# EAGLE design chariot_sensor (EAGLE 9.2.2)
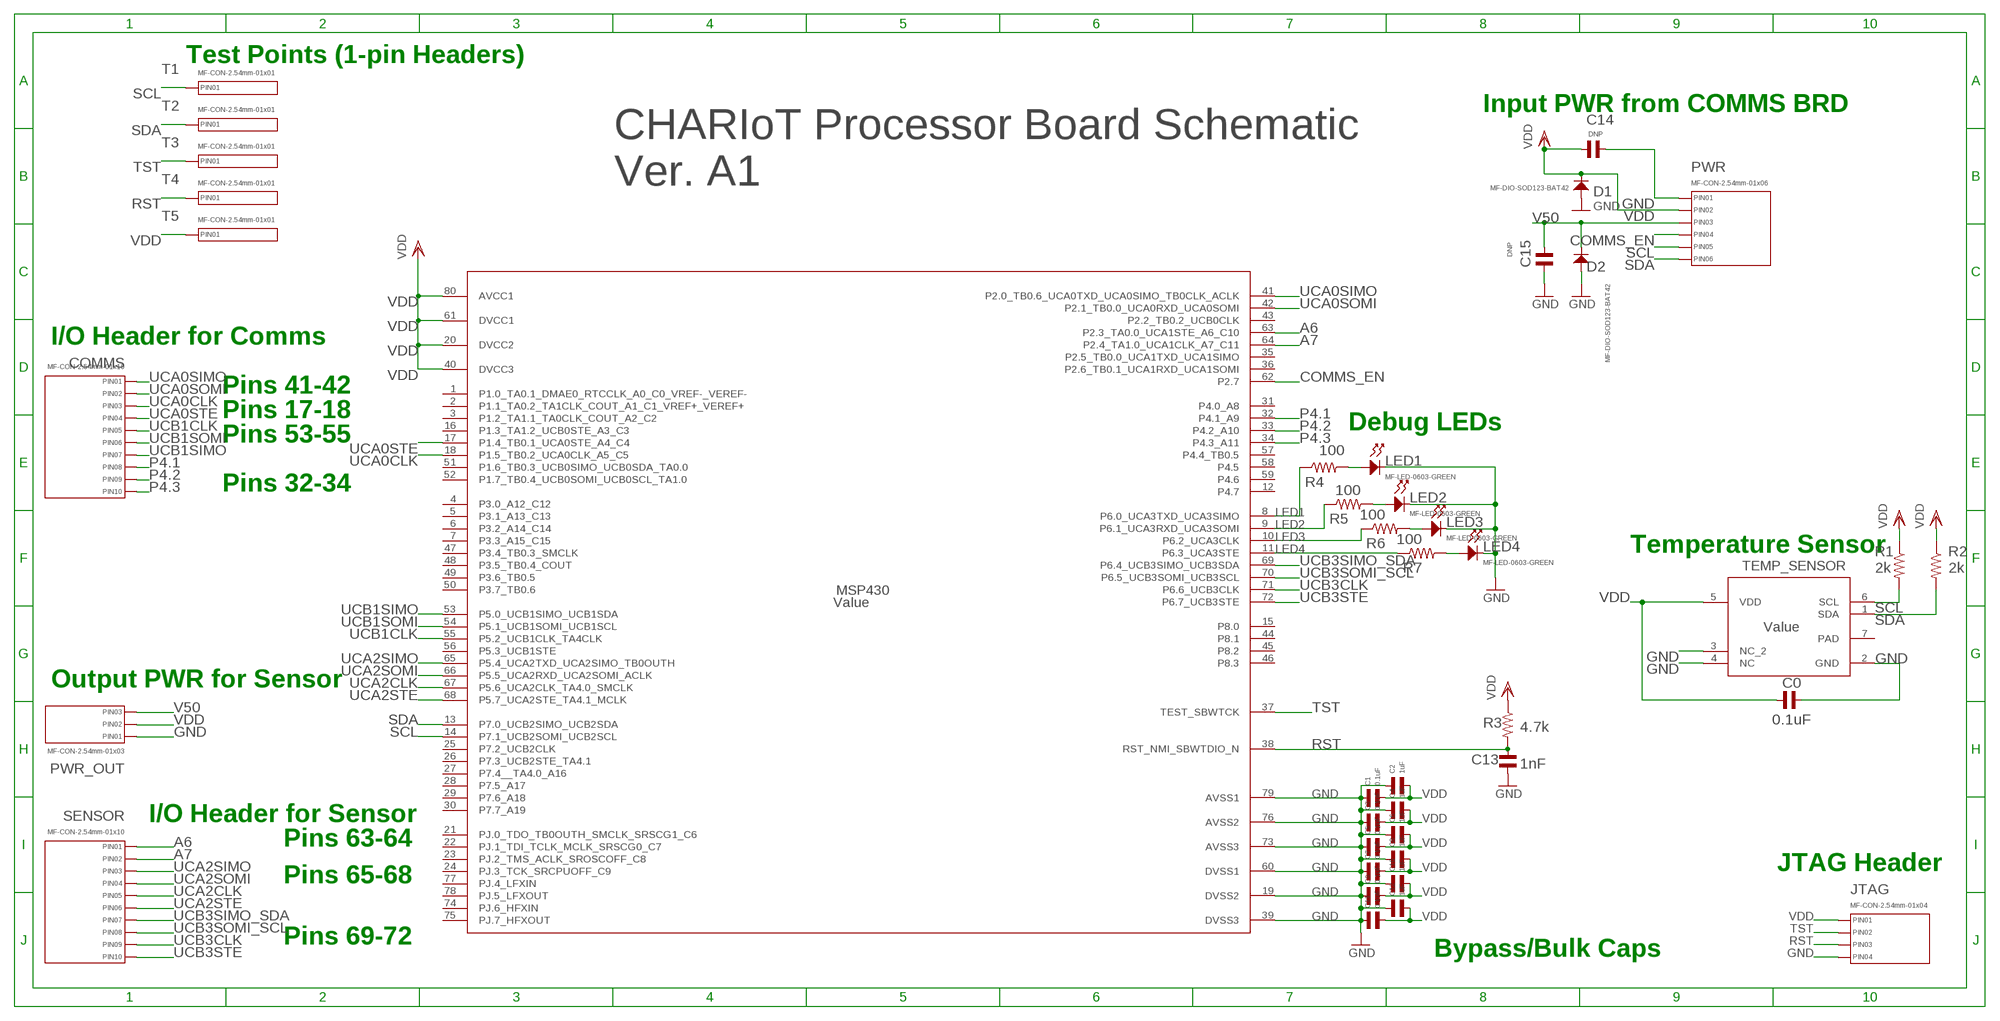
[diagram p0: schematic, sheet 1]

## Parts
C0  0.1uF  CAPACITOR_NP_0603  [C0603]
C1  0.1uF  CAPACITOR_NP_0603  [C0603]
C2  1uF  CAPACITOR_NP_0603  [C0603]
C3  0.1uF  CAPACITOR_NP_0603  [C0603]
C4  1uF  CAPACITOR_NP_0603  [C0603]
C5  0.1uF  CAPACITOR_NP_0603  [C0603]
C6  1uF  CAPACITOR_NP_0603  [C0603]
C7  0.1uF  CAPACITOR_NP_0603  [C0603]
C8  1uF  CAPACITOR_NP_0603  [C0603]
C9  0.1uF  CAPACITOR_NP_0603  [C0603]
C10  1uF  CAPACITOR_NP_0603  [C0603]
C11  0.1uF  CAPACITOR_NP_0603  [C0603]
C12  1uF  CAPACITOR_NP_0603  [C0603]
C13  1nF  CAPACITOR_NP_0603  [C0603]
C14  DNP  CAPACITOR_NP_0603  [C0603]
C15  DNP  CAPACITOR_NP_0603  [C0603]
COMMS  MF-CON-2.54mm-01x10  CON_01X10_PTH_2.54MM  [PTH_2.54MM_01X10]
D1  MF-DIO-SOD123-BAT42  DIODES_BAT42_SOD-123  [SOD-123]
D2  MF-DIO-SOD123-BAT42  DIODES_BAT42_SOD-123  [SOD-123]
JTAG  MF-CON-2.54mm-01x04  CON_01X04_PTH_2.54MM  [PTH_2.54MM_01X04]
LED1  MF-LED-0603-GREEN  LED_SINGLE-0603-GREEN  [LED0603]
LED2  MF-LED-0603-GREEN  LED_SINGLE-0603-GREEN  [LED0603]
LED3  MF-LED-0603-GREEN  LED_SINGLE-0603-GREEN  [LED0603]
LED4  MF-LED-0603-GREEN  LED_SINGLE-0603-GREEN  [LED0603]
MSP430  Value  MSP430FR5994IPNR  [PN0080A_N]
PWR  MF-CON-2.54mm-01x06  CON_01X06_PTH_2.54MM  [PTH_2.54MM_01X06]
PWR_OUT  MF-CON-2.54mm-01x03  CON_01X03_PTH_2.54MM  [PTH_2.54MM_01X03]
R1  2k  RESISTOR_0603  [R0603]
R2  2k  RESISTOR_0603  [R0603]
R3  4.7k  RESISTOR_0603  [R0603]
R4  100  RESISTOR_0603  [R0603]
R5  100  RESISTOR_0603  [R0603]
R6  100  RESISTOR_0603  [R0603]
R7  100  RESISTOR_0603  [R0603]
SENSOR  MF-CON-2.54mm-01x10  CON_01X10_PTH_2.54MM  [PTH_2.54MM_01X10]
T1  MF-CON-2.54mm-01x01  CON_01X01_PTH_2.54MM  [PTH_2.54MM_01X01]
T2  MF-CON-2.54mm-01x01  CON_01X01_PTH_2.54MM  [PTH_2.54MM_01X01]
T3  MF-CON-2.54mm-01x01  CON_01X01_PTH_2.54MM  [PTH_2.54MM_01X01]
T4  MF-CON-2.54mm-01x01  CON_01X01_PTH_2.54MM  [PTH_2.54MM_01X01]
T5  MF-CON-2.54mm-01x01  CON_01X01_PTH_2.54MM  [PTH_2.54MM_01X01]
TEMP_SENSOR  Value  HDC1080DMBR  [DMB0006A]

## Nets
A6: MSP430.63(P2.3_TA0.0_UCA1STE_A6_C10) SENSOR.P$1(PIN1)
A7: MSP430.64(P2.4_TA1.0_UCA1CLK_A7_C11) SENSOR.P$2(PIN2)
COMMS_EN: MSP430.62(P2.7) PWR.P$4(PIN4)
GND: C0.P$2 C1.P$1 C2.P$1 C3.P$1 C4.P$1 C5.P$1 C6.P$1 C7.P$1 C8.P$1 C9.P$1 C10.P$1 C11.P$1 C12.P$1 C13.P$2 C14.P$2 C15.P$2 D1.ANODE D2.ANODE JTAG.P$4(PIN4) LED1.CATHODE LED2.CATHODE LED3.CATHODE LED4.CATHODE MSP430.19(DVSS2) MSP430.39(DVSS3) MSP430.60(DVSS1) MSP430.73(AVSS3) MSP430.76(AVSS2) MSP430.79(AVSS1) PWR.P$1(PIN1) PWR_OUT.P$1(PIN1) TEMP_SENSOR.2(GND) TEMP_SENSOR.3(NC_2) TEMP_SENSOR.4(NC)
LED1: MSP430.8(P6.0_UCA3TXD_UCA3SIMO) R4.P$1
LED2: MSP430.9(P6.1_UCA3RXD_UCA3SOMI) R5.P$1
LED3: MSP430.10(P6.2_UCA3CLK) R6.P$1
LED4: MSP430.11(P6.3_UCA3STE) R7.P$1
N$1: LED1.ANODE R4.P$2
N$2: LED2.ANODE R5.P$2
N$3: LED3.ANODE R6.P$2
N$4: LED4.ANODE R7.P$2
P4.1: COMMS.P$8(PIN8) MSP430.32(P4.1_A9)
P4.2: COMMS.P$9(PIN9) MSP430.33(P4.2_A10)
P4.3: COMMS.P$10(PIN10) MSP430.34(P4.3_A11)
RST: C13.P$1 JTAG.P$3(PIN3) MSP430.38(RST_NMI_SBWTDIO_N) R3.P$2 T4.P$1(PIN1)
SCL: MSP430.14(P7.1_UCB2SOMI_UCB2SCL) PWR.P$5(PIN5) R1.P$2 T1.P$1(PIN1) TEMP_SENSOR.6(SCL)
SDA: MSP430.13(P7.0_UCB2SIMO_UCB2SDA) PWR.P$6(PIN6) R2.P$2 T2.P$1(PIN1) TEMP_SENSOR.1(SDA)
TST: JTAG.P$2(PIN2) MSP430.37(TEST_SBWTCK) T3.P$1(PIN1)
UCA0CLK: COMMS.P$3(PIN3) MSP430.18(P1.5_TB0.2_UCA0CLK_A5_C5)
UCA0SIMO: COMMS.P$1(PIN1) MSP430.41(P2.0_TB0.6_UCA0TXD_UCA0SIMO_TB0CLK_ACLK)
UCA0SOMI: COMMS.P$2(PIN2) MSP430.42(P2.1_TB0.0_UCA0RXD_UCA0SOMI)
UCA0STE: COMMS.P$4(PIN4) MSP430.17(P1.4_TB0.1_UCA0STE_A4_C4)
UCA2CLK: MSP430.67(P5.6_UCA2CLK_TA4.0_SMCLK) SENSOR.P$5(PIN5)
UCA2SIMO: MSP430.65(P5.4_UCA2TXD_UCA2SIMO_TB0OUTH) SENSOR.P$3(PIN3)
UCA2SOMI: MSP430.66(P5.5_UCA2RXD_UCA2SOMI_ACLK) SENSOR.P$4(PIN4)
UCA2STE: MSP430.68(P5.7_UCA2STE_TA4.1_MCLK) SENSOR.P$6(PIN6)
UCB1CLK: COMMS.P$5(PIN5) MSP430.55(P5.2_UCB1CLK_TA4CLK)
UCB1SIMO: COMMS.P$7(PIN7) MSP430.53(P5.0_UCB1SIMO_UCB1SDA)
UCB1SOMI: COMMS.P$6(PIN6) MSP430.54(P5.1_UCB1SOMI_UCB1SCL)
UCB3CLK: MSP430.71(P6.6_UCB3CLK) SENSOR.P$9(PIN9)
UCB3SIMO_SDA: MSP430.69(P6.4_UCB3SIMO_UCB3SDA) SENSOR.P$7(PIN7)
UCB3SOMI_SCL: MSP430.70(P6.5_UCB3SOMI_UCB3SCL) SENSOR.P$8(PIN8)
UCB3STE: MSP430.72(P6.7_UCB3STE) SENSOR.P$10(PIN10)
V50: C15.P$1 D2.CATHODE PWR.P$3(PIN3) PWR_OUT.P$3(PIN3)
VDD: C0.P$1 C1.P$2 C2.P$2 C3.P$2 C4.P$2 C5.P$2 C6.P$2 C7.P$2 C8.P$2 C9.P$2 C10.P$2 C11.P$2 C12.P$2 C14.P$1 D1.CATHODE JTAG.P$1(PIN1) MSP430.20(DVCC2) MSP430.40(DVCC3) MSP430.61(DVCC1) MSP430.80(AVCC1) PWR.P$2(PIN2) PWR_OUT.P$2(PIN2) R1.P$1 R2.P$1 R3.P$1 T5.P$1(PIN1) TEMP_SENSOR.5(VDD)
Unconnected: MSP430.1(P1.0_TA0.1_DMAE0_RTCCLK_A0_C0_VREF-_VEREF-) MSP430.2(P1.1_TA0.2_TA1CLK_COUT_A1_C1_VREF+_VEREF+) MSP430.3(P1.2_TA1.1_TA0CLK_COUT_A2_C2) MSP430.4(P3.0_A12_C12) MSP430.5(P3.1_A13_C13) MSP430.6(P3.2_A14_C14) MSP430.7(P3.3_A15_C15) MSP430.12(P4.7) MSP430.15(P8.0) MSP430.16(P1.3_TA1.2_UCB0STE_A3_C3) MSP430.21(PJ.0_TDO_TB0OUTH_SMCLK_SRSCG1_C6) MSP430.22(PJ.1_TDI_TCLK_MCLK_SRSCG0_C7) MSP430.23(PJ.2_TMS_ACLK_SROSCOFF_C8) MSP430.24(PJ.3_TCK_SRCPUOFF_C9) MSP430.25(P7.2_UCB2CLK) MSP430.26(P7.3_UCB2STE_TA4.1) MSP430.27(P7.4__TA4.0_A16) MSP430.28(P7.5_A17) MSP430.29(P7.6_A18) MSP430.30(P7.7_A19) MSP430.31(P4.0_A8) MSP430.35(P2.5_TB0.0_UCA1TXD_UCA1SIMO) MSP430.36(P2.6_TB0.1_UCA1RXD_UCA1SOMI) MSP430.43(P2.2_TB0.2_UCB0CLK) MSP430.44(P8.1) MSP430.45(P8.2) MSP430.46(P8.3) MSP430.47(P3.4_TB0.3_SMCLK) MSP430.48(P3.5_TB0.4_COUT) MSP430.49(P3.6_TB0.5) MSP430.50(P3.7_TB0.6) MSP430.51(P1.6_TB0.3_UCB0SIMO_UCB0SDA_TA0.0) MSP430.52(P1.7_TB0.4_UCB0SOMI_UCB0SCL_TA1.0) MSP430.56(P5.3_UCB1STE) MSP430.57(P4.4_TB0.5) MSP430.58(P4.5) MSP430.59(P4.6) MSP430.74(PJ.6_HFXIN) MSP430.75(PJ.7_HFXOUT) MSP430.77(PJ.4_LFXIN) MSP430.78(PJ.5_LFXOUT)

## Notes on the sheet
- Test Points (1-pin Headers)
- Input PWR from COMMS BRD
- CHARIoT Processor Board Schematic 
  Ver. A1
- I/O Header for Comms
- Pins 41-42
- Pins 17-18
- Debug LEDs
- Pins 53-55
- Pins 32-34
- Temperature Sensor
- Output PWR for Sensor
- I/O Header for Sensor
- Pins 63-64
- JTAG Header
- Pins 65-68
- Pins 69-72
- Bypass/Bulk Caps

## Power pins joined to a net without a drawn wire
PAD: TEMP_SENSOR.7(PAD)

## Library data of the parts
C0 C1-C15 = MF_Passives:CAPACITOR_NP: Library: MF_Passives Description: Device for Non-Polarized Capacitors. Manufacture part number (MPN) can be added via Attributes. Check https://factory.macrofab.com/parts for the house parts list.; POPULATE: 1
COMMS SENSOR = MF_Connectors:CON_01X10: Library: MF_Connectors Description: Header Connector with 10 Positions and 01 Rows. Use the LABEL Attribute to label the pin on the schematic and PCB. You can remove the attributes on the PCB by using the SMASH function on the part and then deleting the text.; HOUSEPART: YES; MPN: MF-CON-2.54mm-01x10; POPULATE: 1; URL: https://factory.macrofab.com/part/MF-CON-2.54mm-01x10
D1 D2 = MF_Discrete_Semiconductor:DIODES: Library: MF_Discrete_Semiconductor Description: Device for Single Packaged Diodes.; HOUSEPART: YES; MPN: MF-DIO-SOD123-BAT42; POPULATE: 1; URL: https://factory.macrofab.com/part/MF-DIO-SOD123-BAT42
JTAG = MF_Connectors:CON_01X04: Library: MF_Connectors Description: Header Connector with 04 Positions and 01 Rows. Use the LABEL Attribute to label the pin on the schematic and PCB. You can remove the attributes on the PCB by using the SMASH function on the part and then deleting the text.; HOUSEPART: YES; MPN: MF-CON-2.54mm-01x04; POPULATE: 1; URL: https://factory.macrofab.com/part/MF-CON-2.54mm-01x04
LED1-LED4 = MF_LEDs:LED_SINGLE: Library: MF_LEDs Description: Device for Single LED Packages. Manufacture part number (MFG#) can be added via Attributes.; HOUSEPART: YES; MPN: MF-LED-0603-GREEN; POPULATE: 1; URL: https://factory.macrofab.com/part/MF-LED-0603-GREEN
MSP430 = CharIoT:MSP430FR5994IPNR: Processor; MANUFACTURER: Texas Instruments; PARTNUMBER: MSP430FR5994IPNR; REFDES: RefDes; TYPE: TYPE
PWR = MF_Connectors:CON_01X06: Library: MF_Connectors Description: Header Connector with 6 Positions and 01 Rows. Use the LABEL Attribute to label the pin on the schematic and PCB. You can remove the attributes on the PCB by using the SMASH function on the part and then deleting the text.; HOUSEPART: YES; MPN: MF-CON-2.54mm-01x06; POPULATE: 1; URL: https://factory.macrofab.com/part/MF-CON-2.54mm-01x06
PWR_OUT = MF_Connectors:CON_01X03: Library: MF_Connectors Description: Header Connector with 03 Positions and 01 Rows. Use the LABEL Attribute to label the pin on the schematic and PCB. You can remove the attributes on the PCB by using the SMASH function on the part and then deleting the text.; HOUSEPART: YES; MPN: MF-CON-2.54mm-01x03; POPULATE: 1; URL: https://factory.macrofab.com/part/MF-CON-2.54mm-01x03
R1-R7 = MF_Passives:RESISTOR: Library: MF_Passives Description: Device for Resistors. Manufacture part number (MPN), Voltage, Tolerance, and Wattage Rating can be added via Attributes. Check https://factory.macrofab.com/parts for the house parts list.; POPULATE: 1
T1-T5 = MF_Connectors:CON_01X01: Library: MF_Connectors Description: Header Connector with 01 Positions and 01 Rows. Use the LABEL Attribute to label the pin on the schematic and PCB. You can remove the attributes on the PCB by using the SMASH function on the part and then deleting the text.; HOUSEPART: YES; MPN: MF-CON-2.54mm-01x01; POPULATE: 1; URL: https://factory.macrofab.com/part/MF-CON-2.54mm-01x01
TEMP_SENSOR = CharIoT:HDC1080DMBR: Temp Sensor; ALTERNATEPARTNUMBER: HDC1080DMBT; APPLICATION_BUILDNUMBER: *; COMPTYPE: IC; MANUFACTURER: Texas Instruments; MOUNTTYPE: SMT; PACKAGEREFERENCE: DMB0006A; PARTNUMBER: HDC1080DMBR; PIN_COUNT: 7; REFDES: RefDes; TYPE: TYPE

## Board
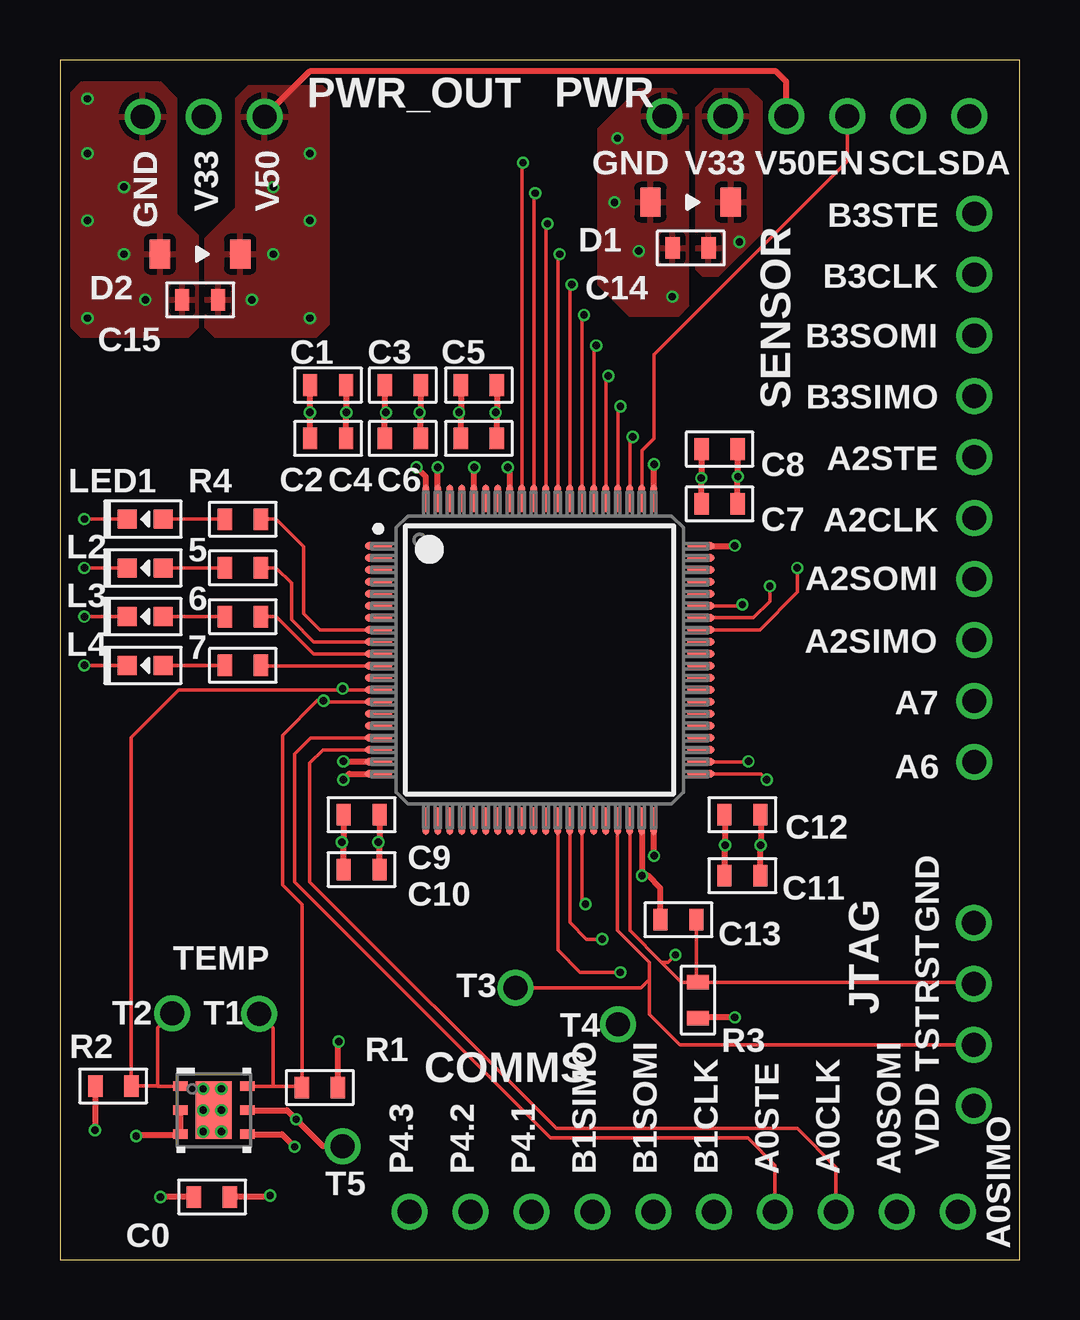
[diagram p1: board, top side]
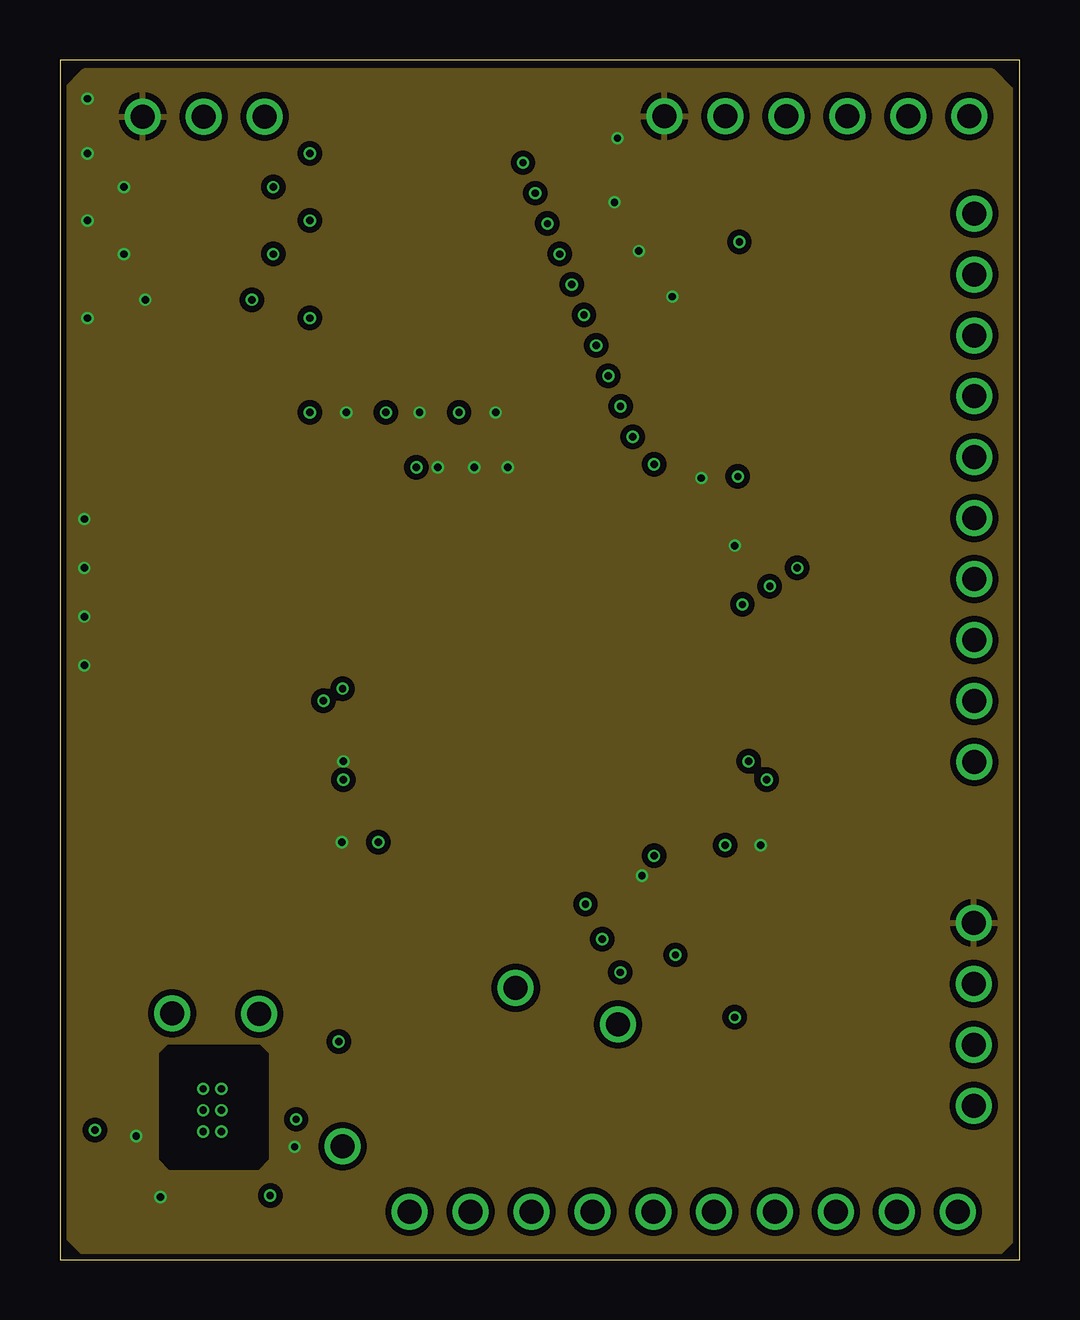
[diagram p2: board, inner layer Route2]
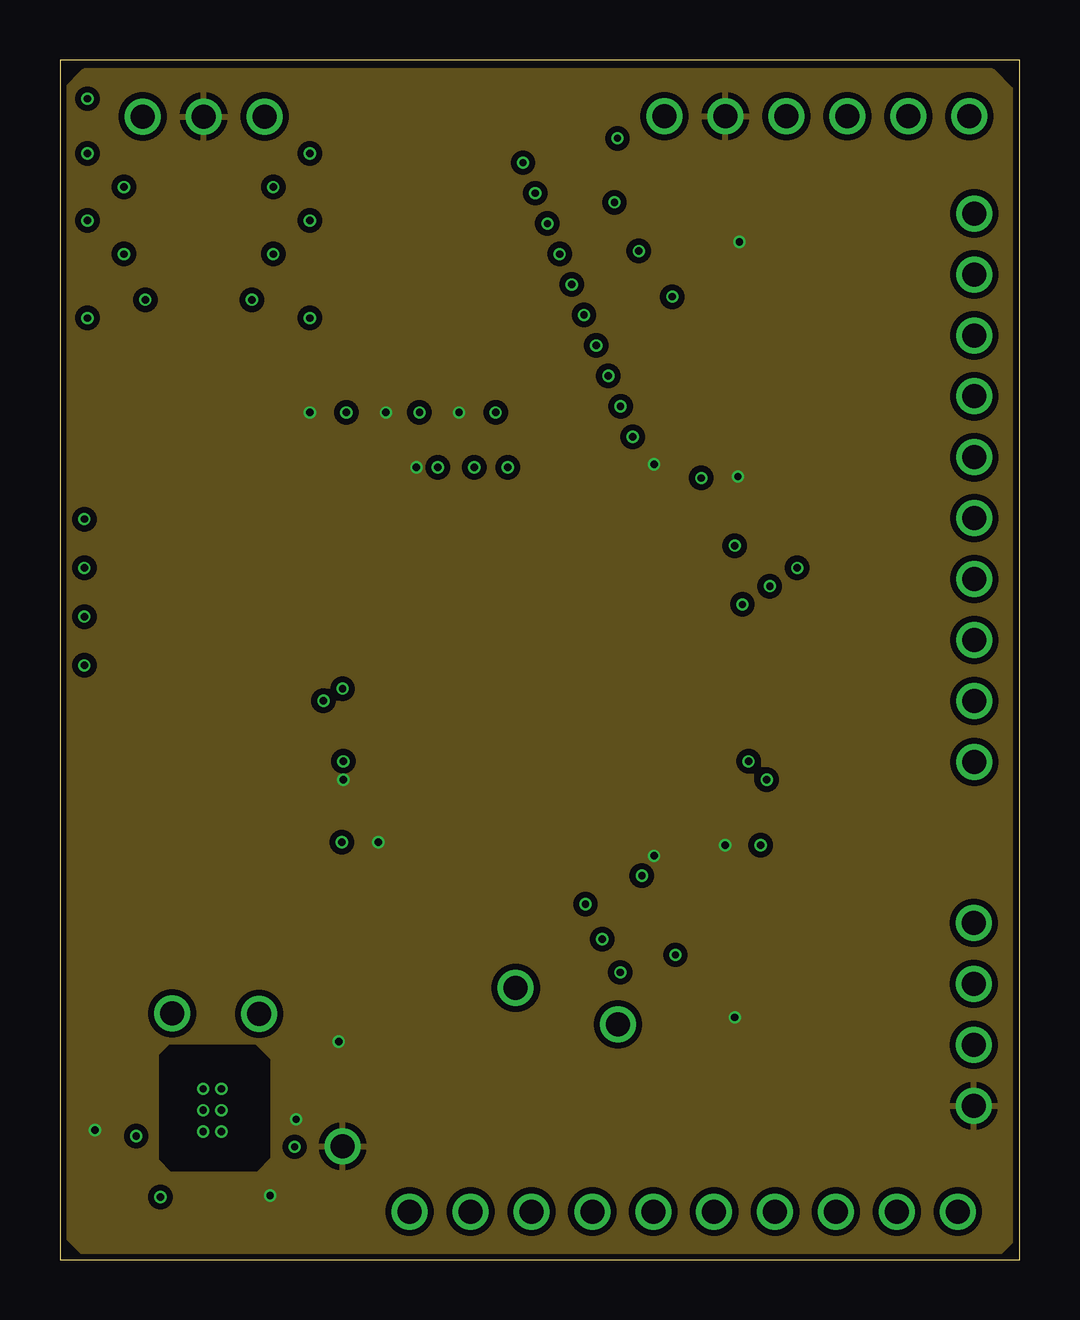
[diagram p3: board, inner layer Route15]
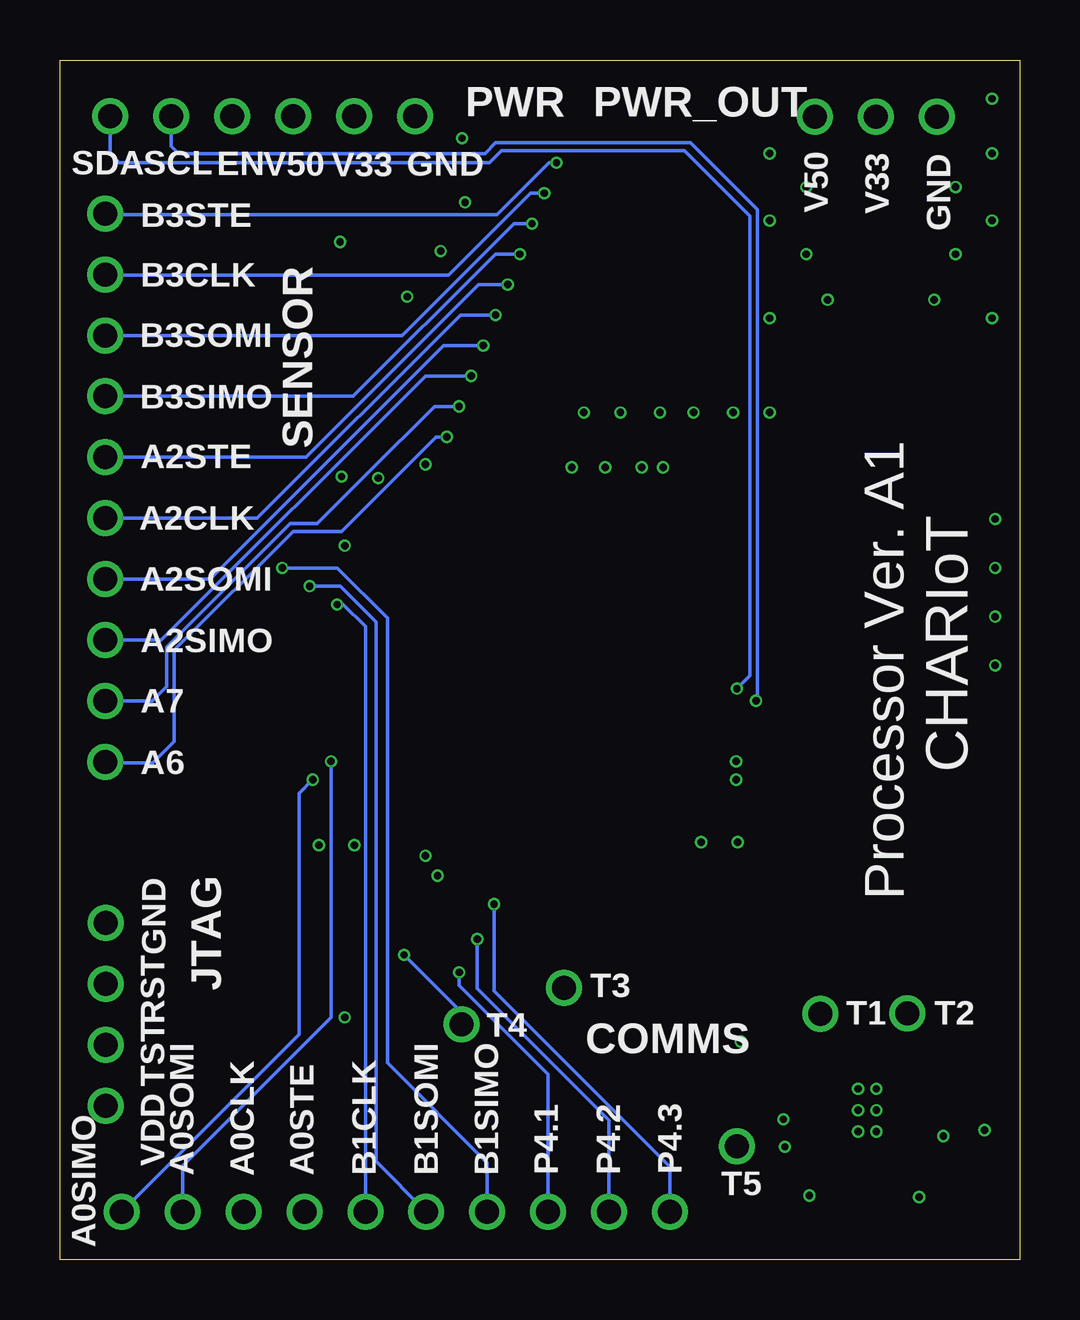
[diagram p4: board, bottom side, seen from below]

Size 40 x 50 mm. Coordinates in mm from the lower left corner, seen from the top.
Outline: 0,0 40,0 40,50 0,50 0,0
Copper layers (1*2*15*16): Top 0.035mm / dielectric 0.23mm / Route2 0.035mm / dielectric 0.93mm / Route15 0.035mm / dielectric 0.23mm / Bottom 0.035mm
Design rules "MF_Standard_4_Layer": minimum track width 5mil, minimum drill 10mil, track to track 5mil, track to pad 5mil, pad to pad 5mil, via to via 5mil, smd to smd 0mil, copper to edge 10mil, drill to drill 10mil, minimum pad ring 4mil, minimum via ring 4mil, stop-mask expansion 2mil, vias tented up to drill 25mil, thermal gap 10mil

### Footprints (pad centres in the part's own frame; a part is rotated, then mirrored left to right if it is on the bottom)
C0603 = smd 0.6 x 0.9: P$1 -0.75,0; P$2 0.75,0
PTH_2.54MM_01X10 = drill 1: P$1 -11.43,0; P$2 -8.89,0; P$3 -6.35,0; P$4 -3.81,0; P$5 -1.27,0; P$6 1.27,0; P$7 3.81,0; P$8 6.35,0; P$9 8.89,0; P$10 11.43,0
SOD-123 = smd 0.85 x 1.2: ANODE 1.675,0; CATHODE -1.675,0
PTH_2.54MM_01X04 = drill 1: P$1 -3.81,0; P$2 -1.27,0; P$3 1.27,0; P$4 3.81,0
LED0603 = smd 0.8 x 0.8: ANODE 0.75,0; CATHODE -0.75,0
PN0080A_N = smd 1.15 x 0.3: 1 -6.725,4.75; 2 -6.725,4.25; 3 -6.725,3.75; 4 -6.725,3.25; 5 -6.725,2.75; 6 -6.725,2.25; 7 -6.725,1.75; 8 -6.725,1.25; 9 -6.725,0.75; 10 -6.725,0.25; 11 -6.725,-0.25; 12 -6.725,-0.75; 13 -6.725,-1.25; 14 -6.725,-1.75; 15 -6.725,-2.25; 16 -6.725,-2.75; 17 -6.725,-3.25; 18 -6.725,-3.75; 19 -6.725,-4.25; 20 -6.725,-4.75; 41 6.725,-4.75; 42 6.725,-4.25; 43 6.725,-3.75; 44 6.725,-3.25; 45 6.725,-2.75; 46 6.725,-2.25; 47 6.725,-1.75; 48 6.725,-1.25; 49 6.725,-0.75; 50 6.725,-0.25; 51 6.725,0.25; 52 6.725,0.75; 53 6.725,1.25; 54 6.725,1.75; 55 6.725,2.25; 56 6.725,2.75; 57 6.725,3.25; 58 6.725,3.75; 59 6.725,4.25; 60 6.725,4.75 | smd 0.3 x 1.15: 21 -4.75,-6.725; 22 -4.25,-6.725; 23 -3.75,-6.725; 24 -3.25,-6.725; 25 -2.75,-6.725; 26 -2.25,-6.725; 27 -1.75,-6.725; 28 -1.25,-6.725; 29 -0.75,-6.725; 30 -0.25,-6.725; 31 0.25,-6.725; 32 0.75,-6.725; 33 1.25,-6.725; 34 1.75,-6.725; 35 2.25,-6.725; 36 2.75,-6.725; 37 3.25,-6.725; 38 3.75,-6.725; 39 4.25,-6.725; 40 4.75,-6.725; 61 4.75,6.725; 62 4.25,6.725; 63 3.75,6.725; 64 3.25,6.725; 65 2.75,6.725; 66 2.25,6.725; 67 1.75,6.725; 68 1.25,6.725; 69 0.75,6.725; 70 0.25,6.725; 71 -0.25,6.725; 72 -0.75,6.725; 73 -1.25,6.725; 74 -1.75,6.725; 75 -2.25,6.725; 76 -2.75,6.725; 77 -3.25,6.725; 78 -3.75,6.725; 79 -4.25,6.725; 80 -4.75,6.725
PTH_2.54MM_01X06 = drill 1: P$1 -6.35,0; P$2 -3.81,0; P$3 -1.27,0; P$4 1.27,0; P$5 3.81,0; P$6 6.35,0
PTH_2.54MM_01X03 = drill 1: P$1 -2.54,0; P$2 0,0; P$3 2.54,0
R0603 = smd 0.6 x 0.9: P$1 -0.75,0; P$2 0.75,0
PTH_2.54MM_01X01 = drill 1: P$1 0,0
DMB0006A = smd 0.6 x 0.4: 1 -1.4,1; 2 -1.4,0; 3 -1.4,-1; 4 1.4,-1; 5 1.4,0; 6 1.4,1 | smd 1.5 x 2.4: 7 0,0

### Placement (x,y rotation side)
C0  6.34,2.61 180 top
C1  11.18,36.45 180 top
C2  11.18,34.23 180 top
C3  14.29,36.45 180 top
C4  14.29,34.23 180 top
C5  17.46,36.45 180 top
C6  17.46,34.23 180 top
C7  27.5,31.5 0 top
C8  27.5,33.78 0 top
C9  12.57,18.54 0 top
C10  12.57,16.26 0 top
C11  28.45,16 180 top
C12  28.45,18.54 180 top
C13  25.78,14.16 180 top
C14  26.29,42.16 180 top
C15  5.84,40.01 180 top
COMMS  26,2 180 top
D1  26.29,44.07 180 top
D2  5.84,41.91 180 top
JTAG  38.1,10.22 90 top
LED1  3.56,30.86 0 top
LED2  3.56,28.83 0 top
LED3  3.56,26.8 0 top
LED4  3.56,24.77 0 top
MSP430  20,25 0 top
PWR  31.55,47.65 0 top
PWR_OUT  5.99,47.65 0 top
R1  10.84,7.17 180 top
R2  2.22,7.23 0 top
R3  26.59,10.81 90 top
R4  7.62,30.86 180 top
R5  7.62,28.83 180 top
R6  7.62,26.8 180 top
R7  7.62,24.77 180 top
SENSOR  38.12,32.17 90 top
T1  8.31,10.24 0 top
T2  4.67,10.26 0 top
T3  19,11.33 0 top
T4  23.27,9.8 0 top
T5  11.79,4.72 0 top
TEMP_SENSOR  6.41,6.22 0 top

### Tracks (layer width: path | path; a pad name or v marks a point on that pad's centre or on a via)
A6  (via drill 0.3)
  Top 0.152: v23.88,34.29 23.75,34.16 MSP430.63
  Bottom 0.152: v23.88,34.29 24.32,34.29 28.26,30.35 30.29,30.35 35.24,25.4 35.24,21.59 36.13,20.7 38.08,20.7 SENSOR.P$1
A7  (via drill 0.3)
  Top 0.152: v23.37,35.56 23.25,35.44 MSP430.64
  Bottom 0.152: v23.37,35.56 24.4,35.56 27.19,32.77 27.19,32.75 29.27,30.67 30.42,30.67 35.56,25.53 35.56,23.88 36.16,23.28 SENSOR.P$2
COMMS_EN
  Top 0.152: PWR.P$4 32.82,45.77 24.77,37.72 24.77,34.23 24.25,33.71 MSP430.62
GND  (via drill 0.3)
  Top 0.152: 3.21,5.18 v3.17,5.14 | 4.2,2.61 v4.19,2.6 | 11.82,17.47 v11.75,17.4 | 11.93,35.29 v11.94,35.31 | C8.P$1 26.73,33.77 | 26.75,32.56 v26.73,32.58 | 17.25,33 v17.27,33.02 | LED1.CATHODE v1.02,30.86 | LED2.CATHODE v1.02,28.83 | LED3.CATHODE v1.02,26.8 | LED4.CATHODE v1.02,24.77
  Top 0.254: C0.P$2 4.2,2.61 | v11.75,17.4 11.82,17.32 C10.P$1 | C2.P$1 11.93,35.29 C1.P$1 | v9.78,4.7 9.26,5.22 TEMP_SENSOR.4 | 26.73,33.77 v26.73,32.58 | C7.P$1 26.75,32.56 | C9.P$1 11.82,17.47 | MSP430.76 17.25,33 | 3.21,5.18 4.97,5.18 TEMP_SENSOR.3 TEMP_SENSOR.2 | C13.P$2 25.03,15.47 24.5,16 v24.26,16 MSP430.39 | C11.P$1 29.2,17.26 v29.21,17.27 C12.P$1 | MSP430.60 v28.12,29.75 v28.13,29.76 | MSP430.73 18.75,32.94 v18.67,33.02 | C6.P$1 18.21,35.26 v18.16,35.31 18.21,35.36 C5.P$1 | C4.P$1 15.04,35.26 | 15.04,35.26 v14.99,35.31 | C3.P$1 15.04,35.26 | MSP430.79 v15.75,33.02 | MSP430.19 11.82,20.75 v11.81,20.77
  other vias: 23.11,44.07 24.13,42.04 23.24,46.74 25.53,40.13 1.14,48.39 1.14,46.1 2.67,44.7 1.14,43.31 2.67,41.91 3.56,40.01 1.14,39.24
  pour Route2 (isolate 0.254): 0.25,1.02 1.02,0.25 39.12,0.25 39.62,0.76 39.62,48.77 38.86,49.53 1.02,49.53 0.25,48.77
  cutout Route2: 4.19,8.51 4.19,4.19 4.57,3.81 8.13,3.81 8.26,3.81 8.64,4.19 8.64,8.57 8.32,8.89 4.51,8.89 4.19,8.57
  pour Top: 24.13,48.77 22.48,47.12 22.48,40.64 23.75,39.37 25.78,39.37 26.16,39.75 26.16,48.13 25.53,48.77
  pour Top: 3.43,49.02 4.19,49.02 4.7,48.51 4.83,48.39 4.83,43.56 5.71,42.67 5.71,38.86 5.33,38.48 3.05,38.48 0.89,38.48 0.51,38.86 0.51,48.64 0.89,49.02
LED1
  Top 0.152: R4.P$1 9.02,30.86 10.16,29.72 10.16,26.92 10.83,26.25 MSP430.8
LED2
  Top 0.152: R5.P$1 9.02,28.83 9.65,28.19 9.65,26.67 10.57,25.75 MSP430.9
LED3
  Top 0.152: R6.P$1 9.02,26.8 10.56,25.25 MSP430.10
LED4
  Top 0.152: MSP430.11 8.38,24.75 R7.P$1
N$1
  Top 0.152: LED1.ANODE R4.P$2
N$2
  Top 0.152: R5.P$2 LED2.ANODE
N$3
  Top 0.152: LED3.ANODE R6.P$2
N$4
  Top 0.152: LED4.ANODE R7.P$2
N$9  (via drill 0.3)
  other vias: 5.97,5.33
N$10  (via drill 0.3)
  other vias: 6.73,5.33
N$11  (via drill 0.3)
  other vias: 6.73,6.22
N$12  (via drill 0.3)
  other vias: 6.73,7.11
N$13  (via drill 0.3)
  other vias: 5.97,7.11
N$14  (via drill 0.3)
  other vias: 5.97,6.22
P4.1  (via drill 0.3)
  Top 0.152: v23.36,11.97 21.69,11.97 20.75,12.9 MSP430.32
  Bottom 0.152: v23.36,11.97 23.36,11.42 19.65,7.71 COMMS.P$8
P4.2  (via drill 0.3)
  Top 0.152: v22.61,13.35 21.95,13.35 21.25,14.06 MSP430.33
  Bottom 0.152: v22.61,13.35 22.61,11.3 17.11,5.81 COMMS.P$9
P4.3  (via drill 0.3)
  Top 0.152: v21.91,14.81 21.75,14.97 MSP430.34
  Bottom 0.152: COMMS.P$10 14.57,3.87 21.91,11.21 v21.91,14.81
RST  (via drill 0.3)
  Top 0.152: JTAG.P$3 38.03,11.56 R3.P$2 | C13.P$1 26.53,11.62 R3.P$2 | R3.P$2 25.91,11.56 25.08,12.38 | 25.08,12.38 23.75,13.71 MSP430.38 | v25.65,12.7 25.34,12.38 25.08,12.38
  Bottom 0.152: T4.P$1 23.27,10.31 v25.65,12.7
SCL  (via drill 0.3)
  Top 0.152: 8.89,7.22 10.03,7.22 R1.P$2 10.09,14.81 9.27,15.62 9.27,21.84 10.72,23.29 v10.99,23.29 11.03,23.25 MSP430.14 | T1.P$1 8.89,9.65 8.89,7.22 | TEMP_SENSOR.6 8.89,7.22
  Bottom 0.152: v10.99,23.29 10.92,23.36 10.92,43.75 13.72,46.55 21.84,46.55 22.29,46.1 35.05,46.1 35.36,46.41 PWR.P$5
SDA  (via drill 0.3)
  Top 0.152: v11.78,23.8 11.8,23.81 11.86,23.75 | 4.06,7.23 R2.P$2 2.97,21.77 4.95,23.75 11.86,23.75 | T2.P$1 4.06,9.65 4.06,7.23 | MSP430.13 11.86,23.75 | TEMP_SENSOR.1 4.07,7.22 4.06,7.23
  Bottom 0.152: PWR.P$6 37.9,46.09 37.53,45.72 22.1,45.72 21.59,46.23 13.97,46.23 11.24,43.5 11.24,24.34 v11.78,23.8
TST
  Top 0.152: JTAG.P$2 25.85,8.95 24.57,10.22 24.57,11.68 | 24.57,11.68 24.57,12.38 23.24,13.72 MSP430.37 | 24.57,11.68 24.22,11.33 T3.P$1
UCA0CLK
  Top 0.152: COMMS.P$3 32.35,3.85 30.73,5.46 20.7,5.46 10.41,15.75 10.41,20.7 10.96,21.25 MSP430.18
UCA0SIMO  (via drill 0.3)
  Top 0.152: v29.46,20 29.22,20.25 MSP430.41
  Bottom 0.152: COMMS.P$1 30.04,9.39 30.04,19.43 v29.46,20
UCA0SOMI  (via drill 0.3)
  Top 0.152: v28.7,20.77 28.69,20.75 MSP430.42
  Bottom 0.152: COMMS.P$2 34.89,3.91 28.7,10.1 v28.7,20.77
UCA0STE
  Top 0.152: COMMS.P$4 29.81,3.94 28.67,5.08 20.45,5.08 9.78,15.75 9.78,21.08 10.45,21.75 MSP430.17
UCA2CLK  (via drill 0.3)
  Top 0.152: v21.84,39.37 21.75,39.28 MSP430.67
  Bottom 0.152: v21.84,39.37 23.3,39.37 31.77,30.9 SENSOR.P$5
UCA2SIMO  (via drill 0.3)
  Top 0.152: v22.86,36.83 22.75,36.72 MSP430.65
  Bottom 0.152: v22.86,36.83 24.77,36.83 35.77,25.82 SENSOR.P$3
UCA2SOMI  (via drill 0.3)
  Top 0.152: v22.35,38.1 22.25,38 MSP430.66
  Bottom 0.152: v22.35,38.1 24,38.1 33.74,28.36 SENSOR.P$4
UCA2STE  (via drill 0.3)
  Top 0.152: v21.34,40.64 21.25,40.55 MSP430.68
  Bottom 0.152: v21.34,40.64 22.54,40.64 29.74,33.44 SENSOR.P$6
UCB1CLK  (via drill 0.3)
  Top 0.152: v28.45,27.3 28.39,27.25 MSP430.55
  Bottom 0.152: v28.45,27.3 28.19,27.3 27.27,26.38 COMMS.P$5
UCB1SIMO  (via drill 0.3)
  Top 0.152: v30.73,28.83 30.73,27.81 29.17,26.25 MSP430.53
  Bottom 0.152: COMMS.P$7 22.19,4.03 26.35,8.19 26.35,26.73 28.45,28.83 v30.73,28.83
UCB1SOMI  (via drill 0.3)
  Top 0.152: v29.59,28.07 29.59,27.43 28.91,26.75 MSP430.54
  Bottom 0.152: v29.59,28.07 28.32,28.07 26.83,26.57 26.83,4.1 COMMS.P$6
UCB3CLK  (via drill 0.3)
  Top 0.152: MSP430.71 19.75,44.39 v19.81,44.45
  Bottom 0.152: v19.81,44.45 20.38,44.45 23.81,41.02 38.08,41.02 SENSOR.P$9
UCB3SIMO_SDA  (via drill 0.3)
  Top 0.152: v20.83,41.91 20.75,41.83 MSP430.69
  Bottom 0.152: v20.83,41.91 21.84,41.91 27.77,35.98 SENSOR.P$7
UCB3SOMI_SCL  (via drill 0.3)
  Top 0.152: v20.32,43.18 20.25,43.11 MSP430.70
  Bottom 0.152: v20.32,43.18 21.08,43.18 25.74,38.52 SENSOR.P$8
UCB3STE  (via drill 0.3)
  Top 0.152: v19.3,45.72 19.25,45.67 MSP430.72
  Bottom 0.152: v19.3,45.72 19.62,45.72 21.78,43.56 38.08,43.56 SENSOR.P$10
V50  (via drill 0.3)
  Top 0.254: PWR.P$3 30.28,49.09 29.84,49.53 10.41,49.53 PWR_OUT.P$3
  other vias: 8,40.01 10.41,39.24 8.89,41.91 10.41,43.31 8.89,44.7 10.41,46.1
  pour Top: 7.87,48.9 7.37,48.39 7.37,48.26 7.37,43.81 6.22,42.67 6.1,42.55 6.1,38.86 6.48,38.48 9.53,38.48 10.67,38.48 11.18,38.99 11.18,48.64 10.92,48.9
VDD  (via drill 0.3)
  Top 0.152: R3.P$1 26.63,10.1 | 1.47,5.41 v1.46,5.4 | 13.32,17.45 v13.27,17.4 | 10.43,35.29 v10.41,35.31 | C1.P$2 10.41,36.44 | 28.25,32.65 v28.26,32.64 | 11.59,9.05 v11.62,9.08 | 24.75,33.13 v24.77,33.15
  Top 0.254: v28.13,10.1 26.63,10.1 | v8.76,2.67 8.71,2.61 C0.P$1 | v13.27,17.4 13.32,17.35 C10.P$2 | C2.P$2 10.43,35.29 | 10.41,36.44 v10.41,35.31 | C8.P$2 28.25,32.65 C7.P$2 | R2.P$1 1.47,5.41 | R1.P$1 11.59,9.05 | C9.P$2 13.32,17.45 | v11.81,20 12.06,20.25 MSP430.20 | v14.86,33.02 15.25,32.63 MSP430.80 | C11.P$2 27.73,16.03 v27.73,17.27 27.73,18.51 C12.P$2 | C6.P$2 16.71,35.38 | 16.71,35.38 v16.64,35.31 | C5.P$2 16.71,35.38 | C4.P$2 13.54,35.26 v13.59,35.31 13.54,35.36 C3.P$2 | T5.P$1 10.96,4.72 v9.84,5.84 9.46,6.22 TEMP_SENSOR.5 | MSP430.61 24.75,33.13 | v24.77,16.83 24.77,18.26 MSP430.40
  other vias: 28.32,42.42
  pour Route15 (isolate 0.254): 1.02,49.53 0.25,48.77 0.25,1.02 1.02,0.25 39.12,0.25 39.62,0.76 39.62,48.77 38.86,49.53
  cutout Route15: 4.51,8.83 4.19,8.51 4.19,5.46 4.19,4.19 4.64,3.75 8.19,3.75 8.7,4.25 8.7,8.32 8.19,8.83 8.13,8.89 4.57,8.89
  pour Top: 27.3,48.77 26.54,48.01 26.54,41.27 26.8,41.02 27.43,41.02 29.21,42.8 29.21,48.26 28.7,48.77

### Text on the board
tNames: GND | V33 | V50 | GND | V33 | V50 | EN | SCL | SDA | B3STE | B3CLK | B3SOMI | B3SIMO | A2STE | A2CLK | L2 | 5 | A2SOMI | L3 | 6 | A2SIMO | L4 | 7 | A7 | A6 | GND | TEMP | RST | TST | P4.3 | P4.2 | P4.1 | B1SIMO | B1SOMI | B1CLK | A0STE | A0CLK | A0SOMI | VDD | A0SIMO
bNames: PWR_OUT | PWR | GND | V33 | V50 | GND | V33 | V50 | EN | SCL | SDA | B3STE | SENSOR | B3CLK | B3SOMI | B3SIMO | A2STE | A2CLK | A2SOMI | A2SIMO | A7 | CHARIoT | A6 | JTAG | GND | Processor Ver. A1 | RST | T3 | T2 | T1 | TST | COMMS | T4 | VDD | P4.3 | P4.2 | P4.1 | B1SIMO | B1SOMI | B1CLK | A0STE | A0SOMI | T5 | A0CLK | A0SIMO
bValues: PWR | SENSOR | SENSOR_PWR | JTAG